# Altium schematic sheet Differential_driver.SchDoc: RP2040 CNC
size B; Author: AM; CompanyName: Expatria Technologies; DrawnBy: A.Marles; Engineer: AM; Organization: Expatria Technolgoies; Address1: PO Box 2084; Address3: Merritt, BC V1K 1B8; Address4: Canada; DocumentNumber: 12; SheetNumber: 28; SheetTotal: 28
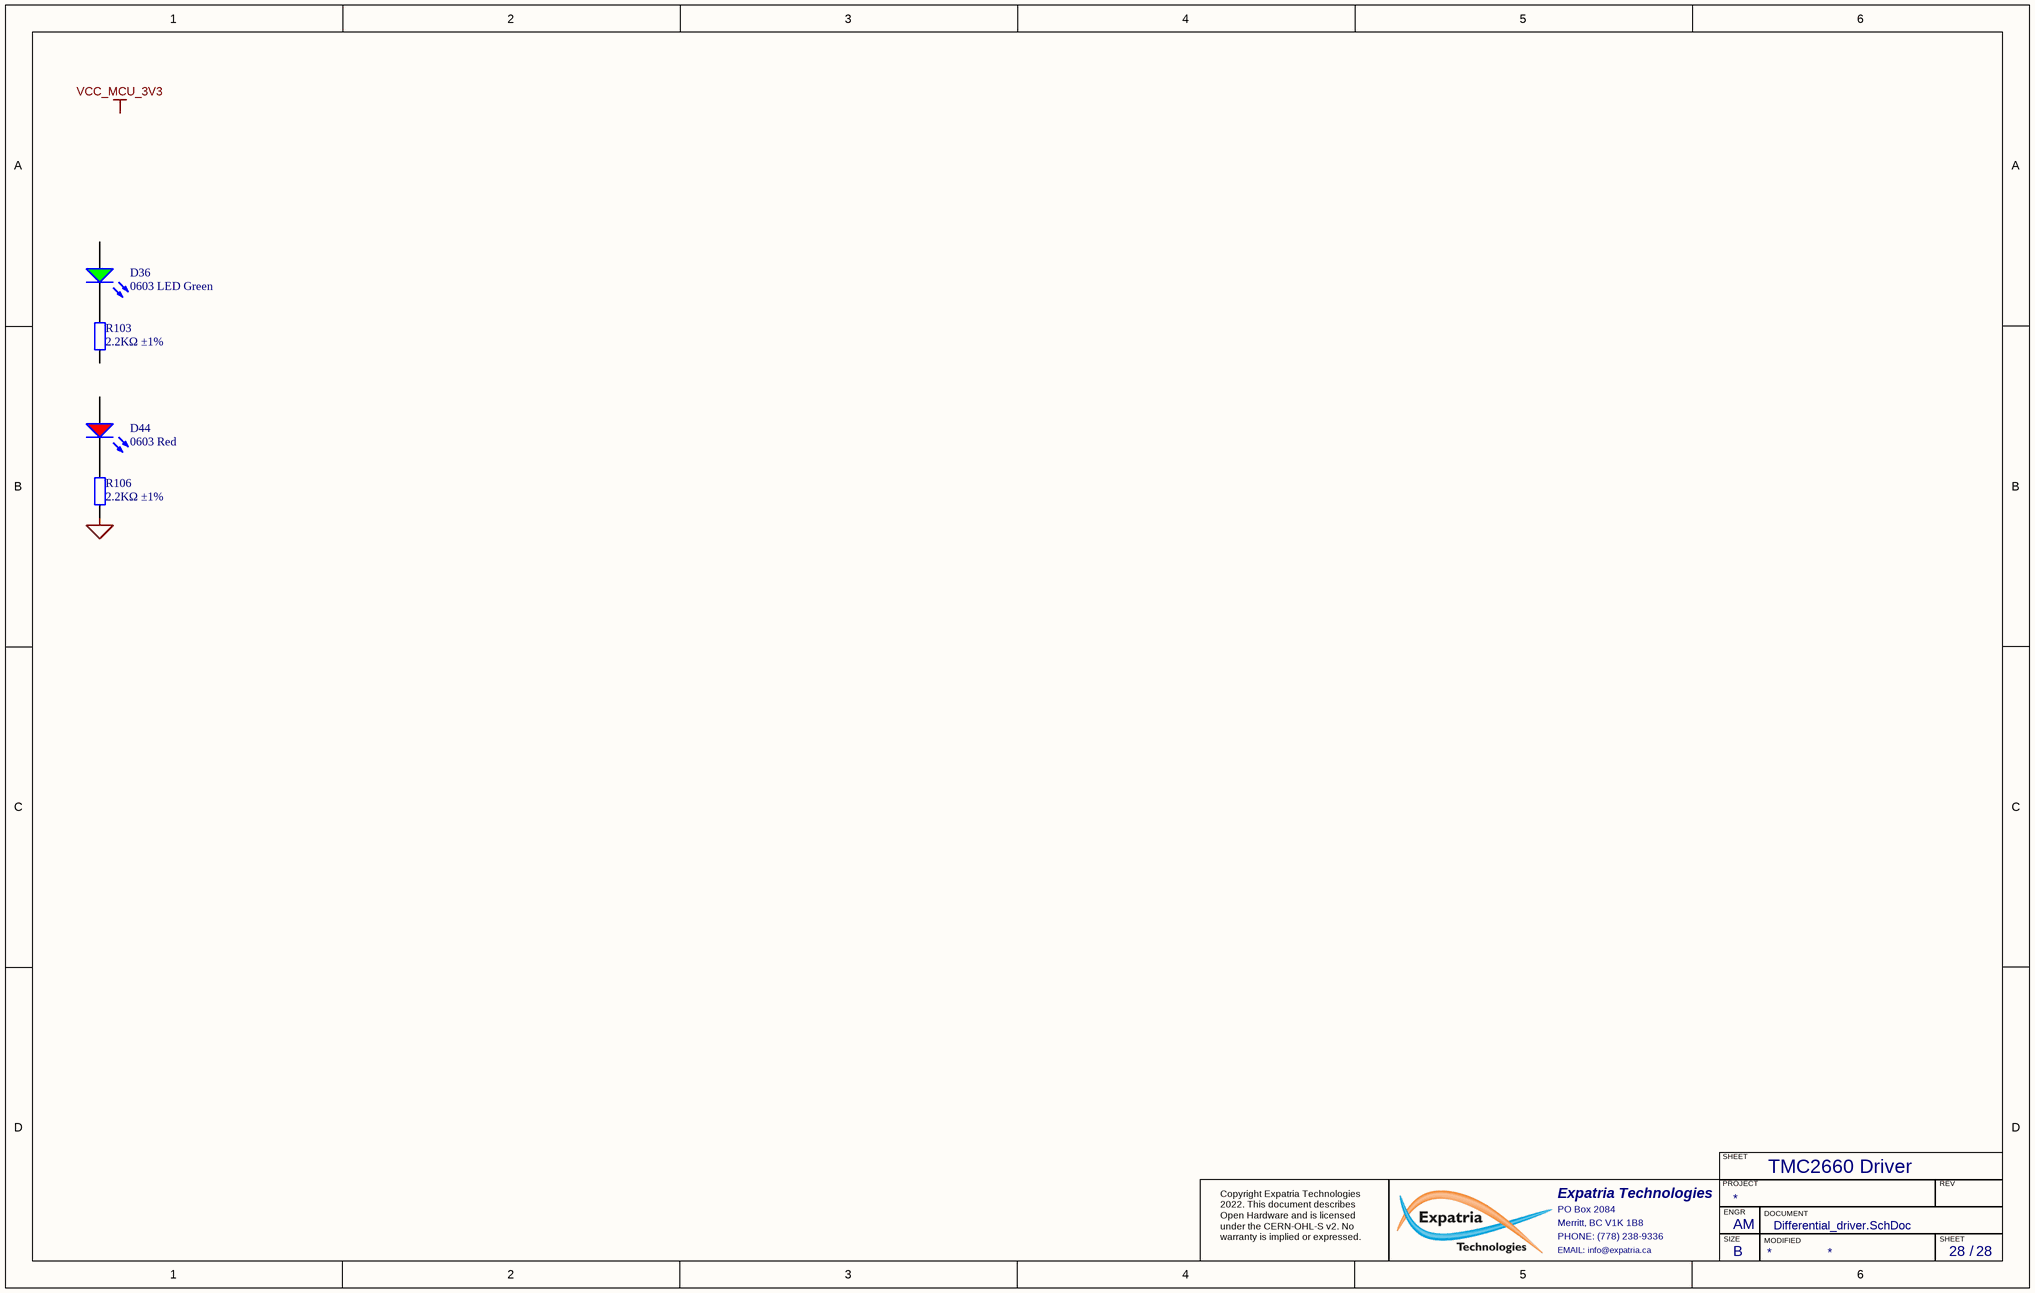
[diagram p0: Differential_driver.SchDoc]

## Parts
D36  0603 LED Green  [0603_LED_S1 - GREEN]
D44  0603 Red  [0603_LED_S1]
R103  2.2KΩ ±1%  [0402_R]
R106  2.2KΩ ±1%  [0402_R]

## Nets
MCU_GND: R106.1
NetD36_K: D36.K R103.2
NetD44_K: D44.K R106.2

Not connected (* = marked no-connect by the designer): D36 A; D44 A; R103 1

## Notes on the sheet
- TMC2660 Driver
- Labels drawn without touching a wire or pin: VCC_MCU_3V3
- SHEET
- Expatria Technologies
- PO Box 2084
- Merritt, BC V1K 1B8
- PHONE: (778) 238-9336
- PROJECT
- SIZE
- ENGR
- MODIFIED
- DOCUMENT
- REV
- Copyright Expatria Technologies 2022. This document describes Open Hardware and is licensed under the CERN-OHL-S v2. No warranty is implied or expressed.
- EMAIL: info@expatria.ca
- B
- /

## Library data of the parts
D36 = 19-217/GHC-YR1S2/3T: Colorless transparence -40℃~+85℃ 520nm~535nm Emerald 120° 110mW 0603 Light Emitting Diodes (LED) ROHS; Manufacturer: Everlight Elec; Package: 0603; Supplier: LC; SuppliersPartNumber: C72043; Color: Green; Manufacturer Part Number: 19-217/GHC-YR1S2/3T
D44 = 19-213SURC/S530-A3/TR8: 20mA 632nm Colorless transparence 624nm~624nm -40℃~+85℃ Red 120° 60mW 0603 Light Emitting Diodes (LED) ROHS; Manufacturer: Everlight Elec; Package: 0603; Supplier: LC; SuppliersPartNumber: C72039; Color: Red; ComponentLink1Description: 供应商链接; ComponentLink1URL: http://www.szlcsc.com/product/details_2659.html; Supplier 1: LC; Supplier Part Number 1: C72039; Manufacturer Part Number: 19-213SURC/S530-A3/TR8
R103 R106 = 0402 2.2K (2201) 1%: Chip resistor; Manufacturer: Uniroyal Elec; Manufacturer Part Number: 0402WGF2201TCE; Power: 1/16W; ComponentLink1Description: Supplier link; ComponentLink1URL: http://www.szlcsc.com/product/details_26622.html; Package: 0402; Supplier: LC; SuppliersPartNumber: C25879; Resistance: 2.2KΩ; Tolerance: 1%